# Altium project SAW-TOOTH-DAC0808.PrjPcb
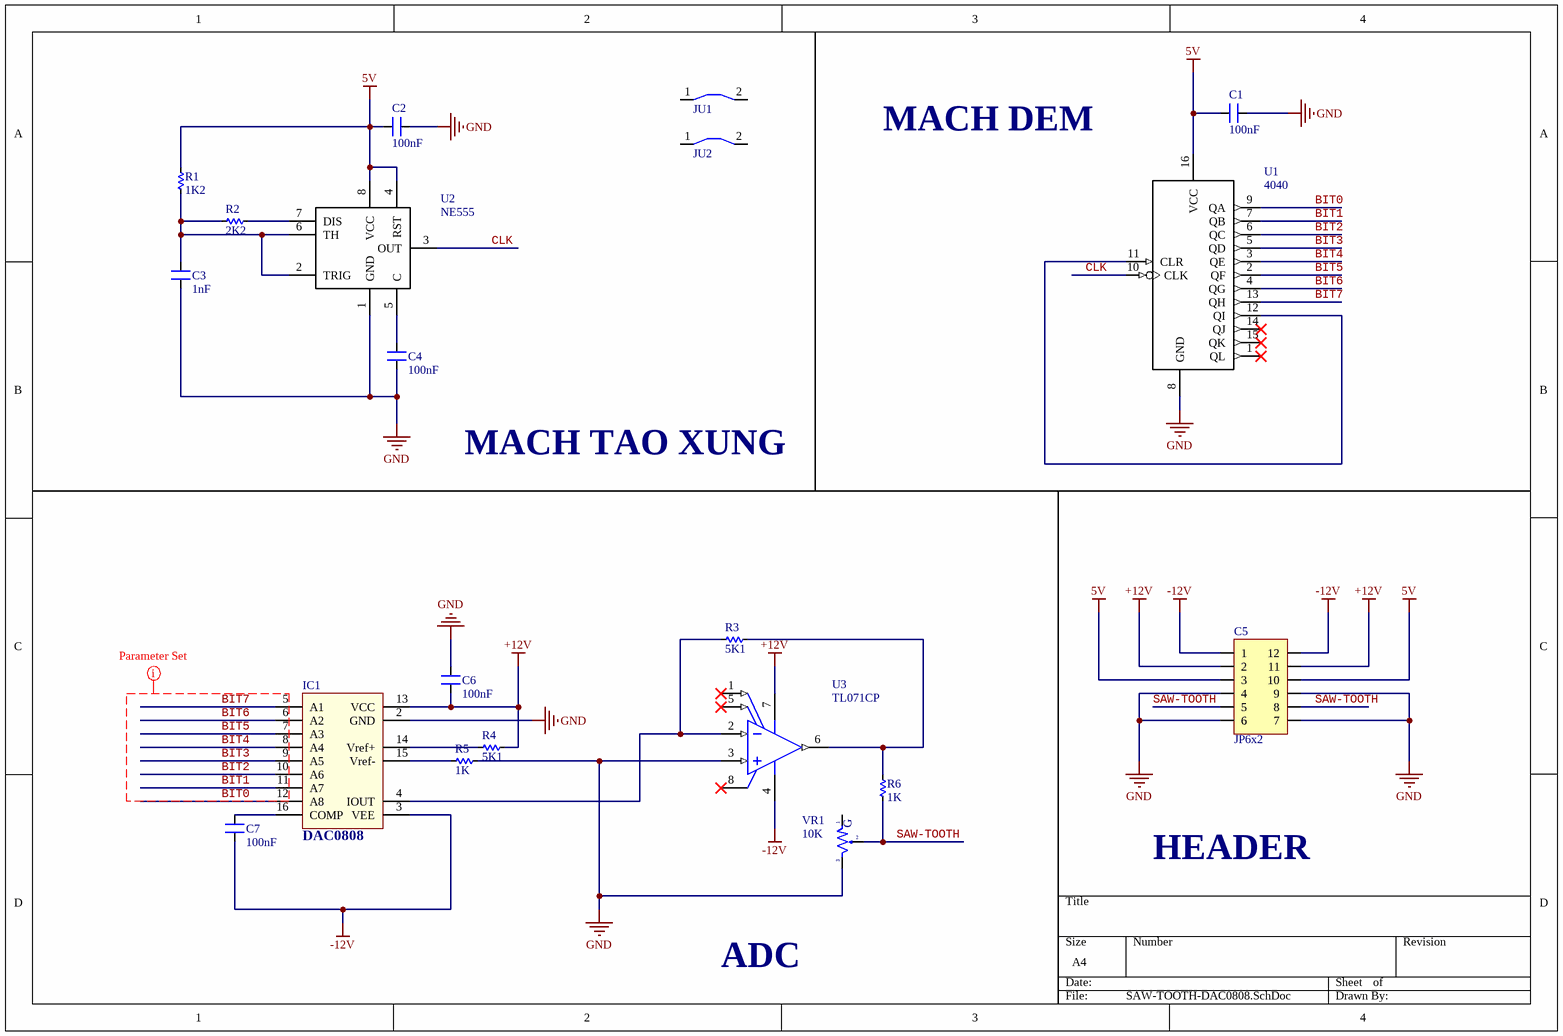
[diagram p0: SAW-TOOTH-DAC0808.SchDoc]
1 sheet, 20 parts. Net scope: global (net labels, ports and power ports of the same name join across sheets).
Board file: SAW-TOOTH-DAC0808.PcbDoc

## Sheet SAW-TOOTH-DAC0808.SchDoc
size A4

### Parts
C1  100nF  [CN1]
C2  100nF  [CN1]
C3  1nF  [CN1]
C4  100nF  [CN1]
C5  JP6x2  [JP6-D2T]
C6  100nF  [CN1]
C7  100nF  [CN1]
IC1  DAC0808  [DIP16]
JU1  JUMPER 5MM  [JUMPER 5MM]  (value not drawn)
JU2  JUMPER 5MM  [JUMPER 5MM]  (value not drawn)
R1  1K2  [RES-1/4W]
R2  2K2  [RES-1/4W]
R3  5K1  [RES-1/4W]
R4  5K1  [RES-1/4W]
R5  1K  [RES-1/4W]
R6  1K  [RES-1/4W]
U1  4040  [DIP16]
U2  NE555  [DIP8]
U3  TL071CP  [P0008A]
VR1  10K  [VR-S1]

### Nets
5V: C1.2 C2.2 C5.3 C5.10 R1.1 U1.16(VCC) U2.4(RST) U2.8(VCC)
+12V: C5.2 C5.11 C6.1 IC1.13(VCC) R4.1 U3.7(VCC+)
-12V: C5.1 C5.12 C7.2 IC1.3(VEE) U3.4(VCC-)
GND: C1.1 C2.1 C3.2 C4.2 C5.4 C5.6 C5.7 C5.9 C6.2 IC1.2(GND) R5.1 U1.8(GND) U2.1(GND) U3.3(IN+) VR1.3
BIT0: IC1.12(A8) U1.9(QA)
BIT1: IC1.11(A7) U1.7(QB)
BIT2: IC1.10(A6) U1.6(QC)
BIT3: IC1.9(A5) U1.5(QD)
BIT4: IC1.8(A4) U1.3(QE)
BIT5: IC1.7(A3) U1.2(QF)
BIT6: IC1.6(A2) U1.4(QG)
BIT7: IC1.5(A1) U1.13(QH)
CLK: U1.10(CLK) U2.3(OUT)
SAW-TOOTH: C5.5 C5.8 R6.2 VR1.2
NetC3_1: C3.1 R1.2 R2.2 U2.2(TRIG) U2.6(TH)
NetC4_1: C4.1 U2.5(C)
NetC7_1: C7.1 IC1.16(COMP)
NetIC1_4: IC1.4(IOUT) R3.2 U3.2(IN-)
NetIC1_14: IC1.14(Vref+) R4.2
NetIC1_15: IC1.15(Vref-) R5.2
NetR2_1: R2.1 U2.7(DIS)
NetR3_1: R3.1 R6.1 U3.6(OUT)
NetU1_11: U1.11(CLR) U1.12(QI)

Not connected (* = marked no-connect by the designer): JU1 1 2; JU2 1 2; U1 1(QL)* 14(QJ)* 15(QK)*; U3 1(OFFSET_N1)* 5(OFFSET_N2)* 8(NC)*; VR1 1

### Layout directives
rule Matched Net Lengths [Tolerance = 0.2mm]; net class BIT: BIT0, BIT1, BIT2, BIT3, BIT4, BIT5, BIT6, BIT7

### Notes on the sheet
- MACH DEM
- MACH TAO XUNG
- HEADER
- ADC
- (in symbol VR-S) G

### Library data of the parts
C1-C4 C6 C7 = CN: Value: 33pF
C5 = JP6x2: WR-PHD 2.54 mm Dual Socket Header; Manufacturer: W¨¹rth Elektronik eiSos GmbH; partNo: 61301221821; ComponentLink1 Description: Manufacturer; ComponentLink2 Description: Datasheet; NoPins: 12; Created Date: 29 March 2013; ComponentLink1URL: http://www.we-online.com; ComponentLink2URL: http://katalog.we-online.de/em/datasheet/6130xx21821.pdf; Created by: Karrer Zheng
IC1 = DAC0808: 8 Bits Digital Analog Convert; Value: DAC0808
R1-R6 = Res: Manufacturer: Generic Components; Class: Passive; SubClass: R; Published: 08/06/2000; Publisher: Altium Hobart Technology Centre
U1 = 4040: ASYNCHRONOUS 12-BIT BINARY COUNTERS
U2 = NE555: TIMER IC; Manufacturer Part Number: NE555DT; Manufacturer: STMicroelectronics; Frequency: 500kHz; Voltage - Supply: 4.5 V ~ 16 V; Current: 200mA; Supplier 1: Digi-Key; Supplier Part Number 1: 497-1962-2-ND; Supplier: Digi-Key; Category: Integrated Circuits (ICs); Supplier Part Number: 497-1962-2-ND; Package / Case: 8-SOIC (3.9mm Width); Packaging: Tape & Reel (TR); RoHS: RoHS Compliant; Operating Temperature: 0°C ~ 70°C; Count: -; Type: 555 Type, Timer/Oscillator (Single)
U3 = CMP-0017-00972-2: Low-Noise JFET-Input General-Purpose Operational Amplifier, 7 to 36 V, 0 to 70 degC, 8-pin DIP (P8), Pb-Free (RoHS); Manufacturer: Texas Instruments; Total Supply Voltage(Min)(+5V is 5, +/-5V is 10): 7; Iq per channel(Max)(mA): 2.5; GBW(Typ)(MHz): 3; Vio (25C)(Max)(mV): 10; CMRR(Min)(dB): 70; Rating: Military; Vn at 1kHz(Typ)(nV/rtHz): 18; IIB(Max)(pA): 200; Number of Channels: 1; Sub Family: General Purpose Amplifier, High Supply Voltage Amplifier (>=30V); Total Supply Voltage(Max)(+5V is 5, +/-5V is 10): 36; Slew Rate(Typ)(V/us): 13; ComponentLink1Description: Manufacturer URL; PackageReference: P0008A; ComponentLink3Description: Package Specification; ComponentLink3URL: http://www.ti.com/litv/pdf/mpdi001b; Mounting Technology: Through Hole; ComponentLink2Description: Datasheet; ComponentLink2URL: http://www.ti.com/lit/ds/symlink/tl071.pdf; PartNumber: TL071CP; Eco-Plan: Pb-Free (RoHS); Offset Drift(Typ)(uV/C): 18; Code_JEDEC: MS-001; DatasheetVersion: SLOS080J; PackageVersion: 4040082/E, 04/2010; PackageDescription: 8-Pin Plastic In-Line, Body 9.59 x 6.35 mm, Pitch 2.54 mm; ComponentLink1URL: http://www.ti.com/
VR1 = VR-S: Var Resistor; Value: Volume 50k